# EasyEDA schematic Miscel.json
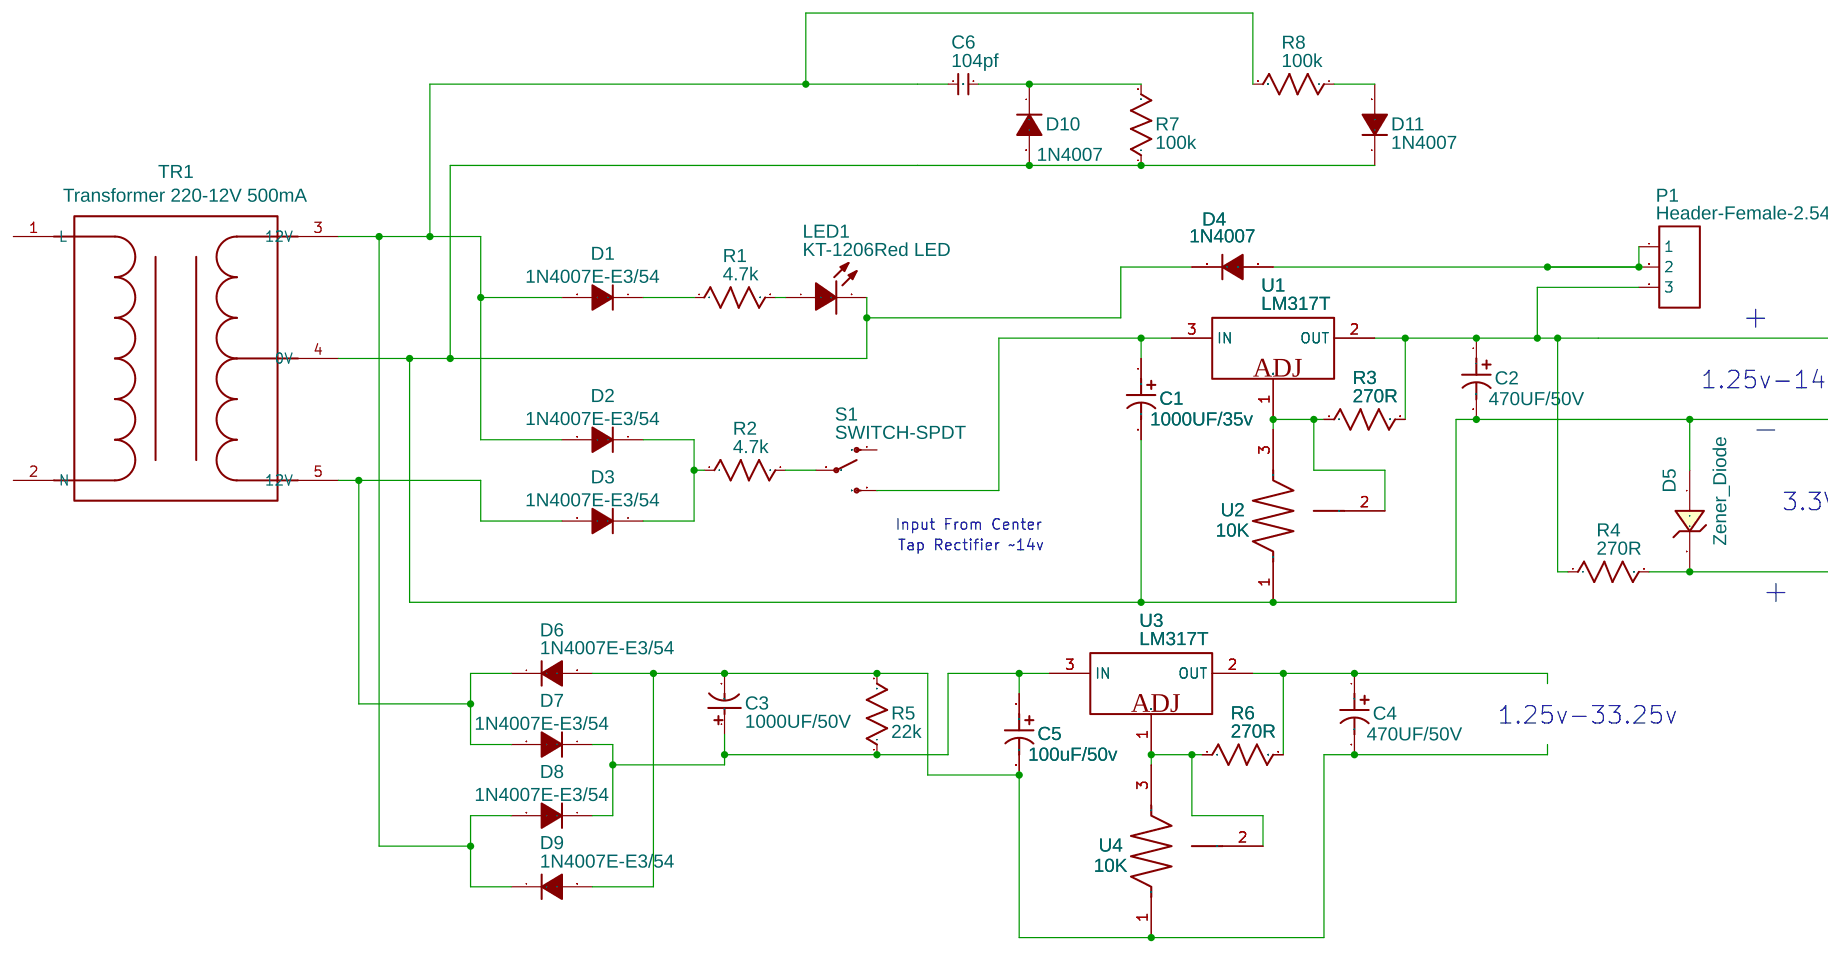
[diagram p0: schematic sheet]

## Parts
C1  1000UF/35v  [CAP-TH_BD8.0-P3.50-D0.6-FD]
C2  470UF/50V  [CAP-TH_BD10.0-P5.00-D0.6-FD]
C3  1000UF/50V  [CAP-TH_BD8.0-P3.50-D0.6-FD_1]
C4  470UF/50V  [CAP-TH_BD10.0-P5.00-D0.6-FD]
C5  100uF/50v  [CAP-TH_BD8.0-P3.50-D0.6-FD]
C6  104pf  [104PF]
D1  1N4007E-E3/54  [DO-41_BD2.4-L4.7-P8.70-D0.9-RD]
D2  1N4007E-E3/54  [DO-41_BD2.4-L4.7-P8.70-D0.9-RD]
D3  1N4007E-E3/54  [DO-41_BD2.4-L4.7-P8.70-D0.9-RD]
D4  1N4007  [DO-41_BD2.4-L4.7-P8.70-D0.9-RD]
D5  Zener_Diode  [DC-ZENER-DIODE]
D6  1N4007E-E3/54  [DO-41_BD2.4-L4.7-P8.70-D0.9-RD]
D7  1N4007E-E3/54  [DO-41_BD2.4-L4.7-P8.70-D0.9-RD]
D8  1N4007E-E3/54  [DO-41_BD2.4-L4.7-P8.70-D0.9-RD]
D9  1N4007E-E3/54  [DO-41_BD2.4-L4.7-P8.70-D0.9-RD]
D10  1N4007  [DO-41_BD2.4-L4.7-P8.70-D0.9-RD]
D11  1N4007  [DO-41_BD2.4-L4.7-P8.70-D0.9-RD]
LED1  KT-1206Red LED  [LED1206-R-RD]
P1  Header-Female-2.54_1x3  [HDR-TH_3P-P2.54-V-F]
R1  4.7k  [R0603]
R2  4.7k  [R0603]
R3  270R  [R0603]
R4  270R  [R0603]
R5  22k  [R0603]
R6  270R  [R0603]
R7  100k  [R0603]
R8  100k  [R0603]
S1  SWITCH-SPDT  [SWITCHE-DPDT]
TR1  Transformer 220-12V 500mA  [TRANSFORMER]
U1  LM317T  [LM317T]
U2  10K  [C10K POTENTIOMETER]
U3  LM317T  [LM317T]
U4  10K  [C10K POTENTIOMETER]

## Library data of the parts
C1 C5 = 100UF/50V: Supplier: LCSC; Supplier Part: C9900004739; Manufacturer Part: 100uF/50V; Contributor: LCSC; JLCPCB Part Class: Extended Part; Manufacturer: null
C2 C4 = 470UF/50V-10X20: Supplier: LCSC; Supplier Part: C9900005233; Manufacturer: null; Manufacturer Part: 470uF/50V-10x20; Contributor: LCSC; JLCPCB Part Class: Extended Part
C3 = 1000UF/50V: Supplier: LCSC; Supplier Part: C9900023728; Manufacturer: null; Manufacturer Part: 1000uF/50V; Contributor: lcsc; JLCPCB Part Class: Extended Part
C6 = 104pf: Contributor: Mutloob Electronic Solution (E & E Tips)
D1-D4 D6-D11 = 1N4007E-E3/54: Supplier: LCSC; Manufacturer: VISHAY(威世); Contributor: LCSC; Supplier Part: C144970; JLCPCB Part Class: Extended Part
D5 = Zener_Diode: Contributor: dina
LED1 = KT-1206Red LED: Supplier: LCSC; Manufacturer: KENTO; image: //image.lceda.cn/szlcsc/C49018.jpg; Supplier Part: C49018; JLCPCB Part Class: Extended Part; Contributor: geminisblack
P1 = Header-Female-2.54_1x3: Supplier Part: C146243; Supplier: LCSC; Manufacturer: BOOMELE(博穆精密); Manufacturer Part: 2.54-1*3P母; link: https://datasheet.lcsc.com/szlcsc/Boom-Precision-Elec-2-54mm-1-8P-Straight-Female-header_C27438.pdf; JLCPCB Part Class: Extended Part
R1-R8 = R_0603_US: Contributor: LCEDA_Lib
S1 = SWITCH-SPDT: Contributor: SparkFun
TR1 = Transformer 220-12V 500mA: Contributor: sitecon007
U1 U3 = LM317T
U2 U4 = POTENTIOMETER: Contributor: tcordella80

## Nets
Net-(C1-1): C1.1 S1.3(S) U1.3(IN)
Net-(C1-2): C1.2 C2.2 D4.1(K) D5.1(A) D10.2(A) D11.1(K) LED1.2(K) R7.1 TR1.4(0V) U2.1
Net-(C2-1): C2.1 P1.3 R3.2 R4.1 U1.2(OUT)
Net-(C3-1): C3.1 C5.1 D7.1(K) D8.1(K) R5.1 U3.3(IN)
Net-(C3-2): C3.2 C4.2 C5.2 D6.2(A) D9.2(A) R5.2 U4.1
Net-(C4-1): C4.1 R6.2 U3.2(OUT)
Net-(C6-1): C6.1 D1.2(A) D2.2(A) D8.2(A) D9.1(K) R8.2 TR1.3(12V)
Net-(C6-2): C6.2 D10.1(K) R7.2
Net-(D1-1): D1.1(K) R1.1
Net-(D2-1): D2.1(K) D3.1(K) R2.1
Net-(D3-2): D3.2(A) D6.1(K) D7.2(A) TR1.5(12V)
Net-(D4-2): D4.2(A) P1.1 P1.2
Net-(D5-2): D5.2(K) R4.2
Net-(D11-2): D11.2(A) R8.1
Net-(LED1-1): LED1.1(A) R1.2
Net-(R2-2): R2.2 S1.2(P)
Net-(R3-1): R3.1 U1.1(ADJ) U2.2 U2.3
Net-(R6-1): R6.1 U3.1(ADJ) U4.2 U4.3

Not connected (* = marked no-connect by the designer): S1 1(O); TR1 1(L) 2(N)

## Notes on the sheet
- +
- 1.25v-14.25v
- -
- 3.3V
- Input From Center
- Tap Rectifier ~14v
- +
- 1.25v-33.25v
